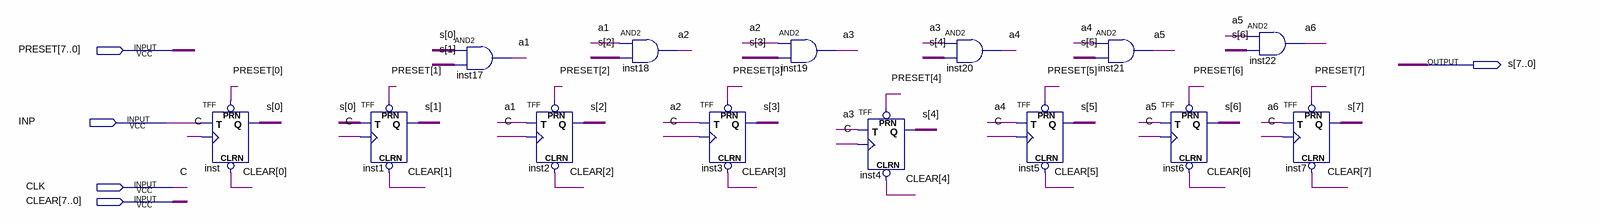
[diagram p0: schematic sheet]
// Quartus schematic counter.bdf as structural Verilog: 14 symbols, 5 pins
module counter (
  input  [7:0] PRESET,
  input  INP,
  input  CLK,
  input  [7:0] CLEAR,
  output [7:0] s
);

  wire a1, a2, a3, a4, a5, a6;

  TFF inst (.PRN(PRESET[0]), .CLRN(CLEAR[0]), .T(INP), .CLK(CLK), .Q(s[0]));
  TFF inst1 (.PRN(PRESET[1]), .CLRN(CLEAR[1]), .T(s[0]), .CLK(CLK), .Q(s[1]));
  and inst17 (a1, s[0], s[1]);
  TFF inst2 (.PRN(PRESET[2]), .CLRN(CLEAR[2]), .T(a1), .CLK(CLK), .Q(s[2]));
  and inst18 (a2, a1, s[2]);
  TFF inst3 (.PRN(PRESET[3]), .CLRN(CLEAR[3]), .T(a2), .CLK(CLK), .Q(s[3]));
  and inst19 (a3, a2, s[3]);
  TFF inst4 (.PRN(PRESET[4]), .CLRN(CLEAR[4]), .T(a3), .CLK(CLK), .Q(s[4]));
  and inst20 (a4, a3, s[4]);
  TFF inst5 (.PRN(PRESET[5]), .CLRN(CLEAR[5]), .T(a4), .CLK(CLK), .Q(s[5]));
  and inst21 (a5, a4, s[5]);
  TFF inst6 (.PRN(PRESET[6]), .CLRN(CLEAR[6]), .T(a5), .CLK(CLK), .Q(s[6]));
  and inst22 (a6, a5, s[6]);
  TFF inst7 (.PRN(PRESET[7]), .CLRN(CLEAR[7]), .T(a6), .CLK(CLK), .Q(s[7]));

  // Other names for the same wires on the sheet: C = CLK
endmodule
